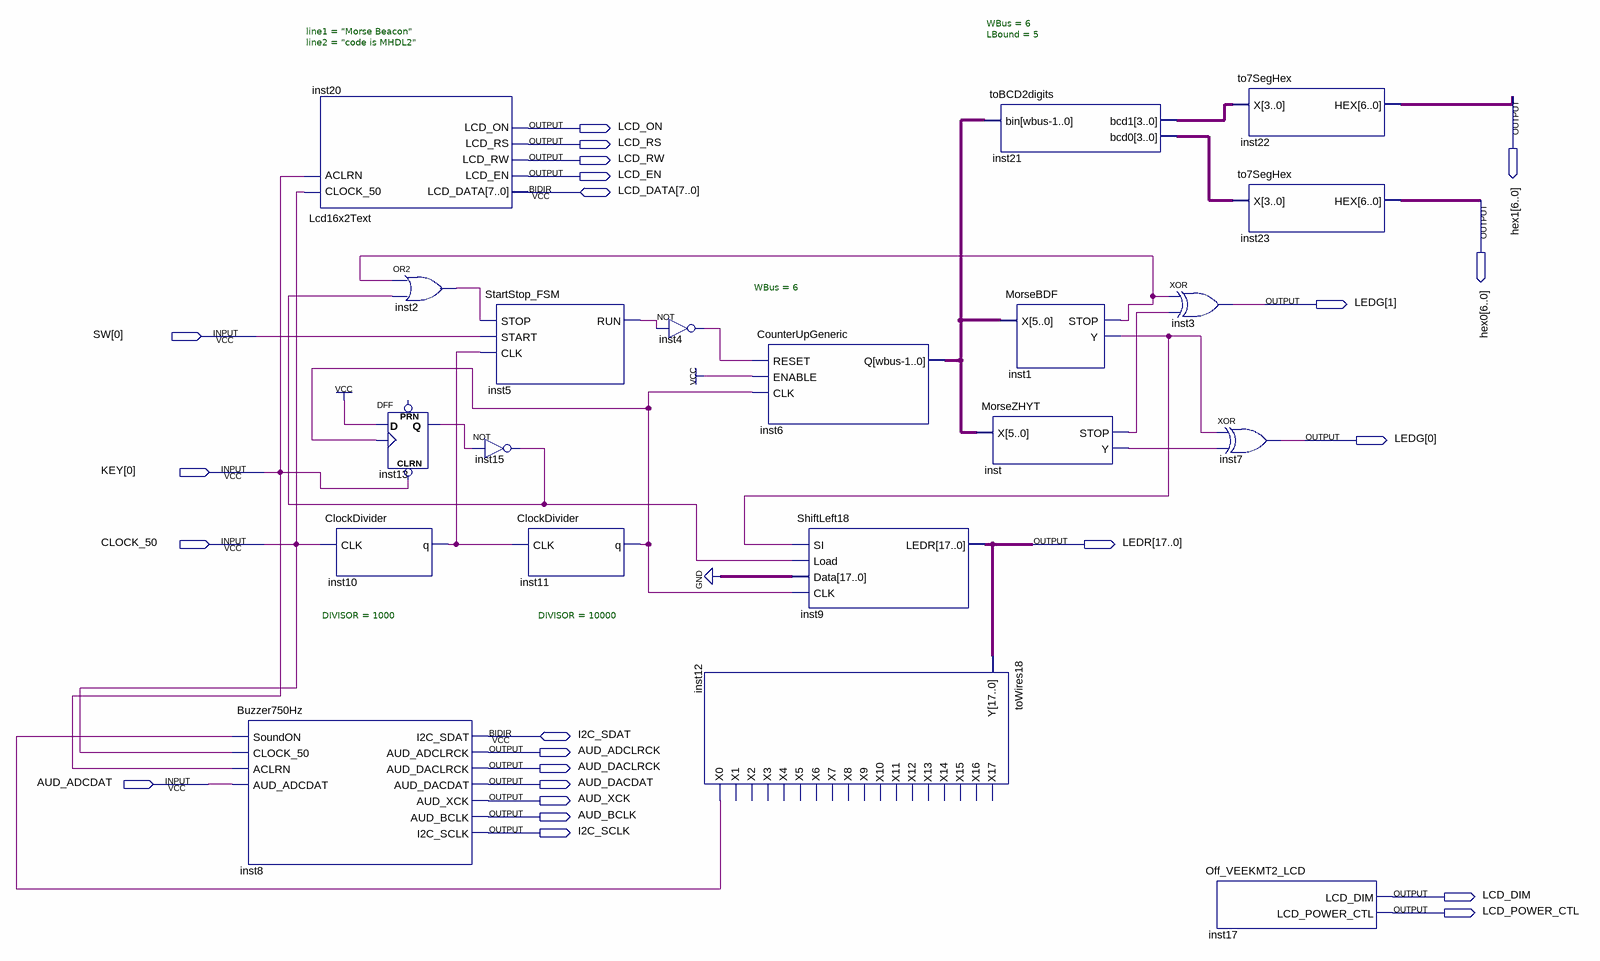
[diagram p0: schematic sheet]
// Quartus schematic MorseZhytnboh.bdf as structural Verilog: 20 symbols, 23 pins
module MorseZhytnboh (
  input  [0:0] SW,
  input  [0:0] KEY,
  input  CLOCK_50,
  input  AUD_ADCDAT,
  inout  [7:0] LCD_DATA,
  inout  I2C_SDAT,
  output [6:0] hex1,
  output LCD_ON,
  output LCD_RS,
  output LCD_RW,
  output LCD_EN,
  output [6:0] hex0,
  output [1:0] LEDG,
  output [17:0] LEDR,
  output AUD_ADCLRCK,
  output AUD_DACLRCK,
  output AUD_DACDAT,
  output AUD_XCK,
  output AUD_BCLK,
  output I2C_SCLK,
  output LCD_DIM,
  output LCD_POWER_CTL
);

  wire inst1_stop, inst1_y, inst2_out, inst4_out, inst5_run, inst10_q, inst11_q, inst12_x0, inst13_q,
       inst15_out, inst_stop, inst_y;
  wire [3:0] inst21_bcd0, inst21_bcd1;
  wire [5:0] inst6_q;

  Buzzer750Hz inst8 (
    .SoundON(inst12_x0), .CLOCK_50(CLOCK_50), .ACLRN(KEY[0]), .AUD_ADCDAT(AUD_ADCDAT),
    .AUD_ADCLRCK(AUD_ADCLRCK), .AUD_DACLRCK(AUD_DACLRCK), .AUD_DACDAT(AUD_DACDAT), .AUD_XCK(AUD_XCK),
    .AUD_BCLK(AUD_BCLK), .I2C_SCLK(I2C_SCLK), .I2C_SDAT(I2C_SDAT));
  Lcd16x2Text #(.line1("Morse Beacon"), .line2("code is MHDL2")) inst20 (
    .CLOCK_50(CLOCK_50), .ACLRN(KEY[0]), .LCD_EN(LCD_EN), .LCD_RW(LCD_RW), .LCD_RS(LCD_RS), .LCD_ON(LCD_ON),
    .LCD_DATA(LCD_DATA));
  DFF inst13 (.CLRN(KEY[0]), .CLK(inst11_q), .D(1'b1), .Q(inst13_q));  // open: PRN
  ClockDivider #(.DIVISOR(1000)) inst10 (.CLK(CLOCK_50), .q(inst10_q));
  or inst2 (inst2_out, inst1_stop, inst15_out);
  StartStop_FSM inst5 (.STOP(inst2_out), .START(SW[0]), .CLK(inst10_q), .RUN(inst5_run));
  not inst15 (inst15_out, inst13_q);
  ClockDivider #(.DIVISOR(10000)) inst11 (.CLK(inst10_q), .q(inst11_q));
  not inst4 (inst4_out, inst5_run);
  toWires18 inst12 (
    .Y(LEDR), .X0(inst12_x0));  // open: X17, X16, X15, X14, X13, X12, X11, X10, X9, X8, X7, X6, X5, X4, X3, X2, X1
  CounterUpGeneric #(.WBus(6)) inst6 (.RESET(inst4_out), .ENABLE(1'b1), .CLK(inst11_q), .Q(inst6_q));
  ShiftLeft18 inst9 (.SI(inst1_y), .Load(inst15_out), .Data({18{1'b0}}), .CLK(inst11_q), .LEDR(LEDR));
  toBCD2digits #(.WBus(6), .LBound(5)) inst21 (.bin(inst6_q), .bcd1(inst21_bcd1), .bcd0(inst21_bcd0));
  MorseBDF inst1 (.X(inst6_q), .STOP(inst1_stop), .Y(inst1_y));
  MorseZHYT inst (.X(inst6_q), .STOP(inst_stop), .Y(inst_y));
  xor inst3 (LEDG[1], inst1_stop, inst_stop);
  Off_VEEKMT2_LCD inst17 (.LCD_DIM(LCD_DIM), .LCD_POWER_CTL(LCD_POWER_CTL));
  to7SegHex inst22 (.X(inst21_bcd1), .HEX(hex1));
  to7SegHex inst23 (.X(inst21_bcd0), .HEX(hex0));
  xor inst7 (LEDG[0], inst1_y, inst_y);
endmodule
